# EAGLE design lcdInterface (EAGLE 6.4)
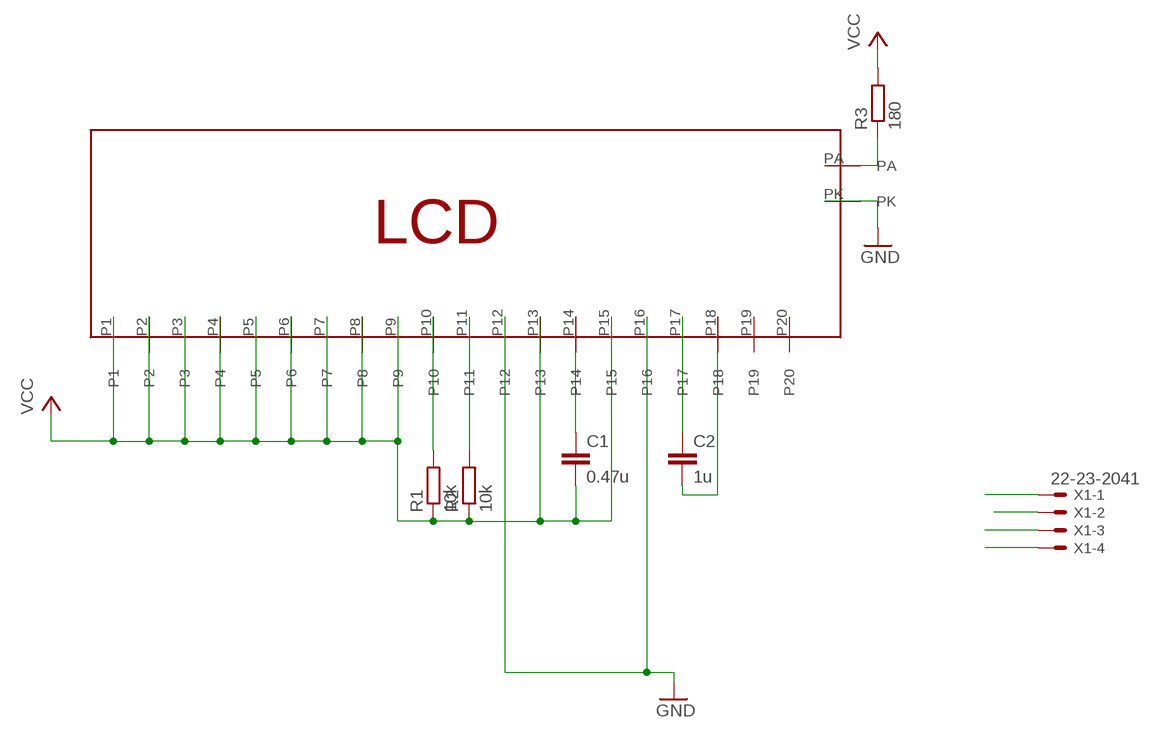
[diagram p0: schematic, sheet 1]

## Parts
C1  0.47u  C-EU050-055X075  [C050-055X075]
C2  1u  C-EU050-030X075  [C050-030X075]
R1  10k  R-EU_0207/10  [0207/10]
R2  10k  R-EU_0207/10  [0207/10]
R3  180  R-EU_0207/10  [0207/10]
U$1  GE-01602F  [GE01602F]
X1  22-23-2041  [22-23-2041]

## Nets
GND: U$1.P12 U$1.P16 U$1.PK X1.4
N$3: R3.1 U$1.PA
N$4: C1.1 U$1.P14
N$5: C2.1 U$1.P17
N$6: C2.2 U$1.P18
SCL: R1.2 U$1.P10 X1.1
SDA: R2.2 U$1.P11 X1.2
VCC: C1.2 R1.1 R2.1 R3.2 U$1.P1 U$1.P2 U$1.P3 U$1.P4 U$1.P5 U$1.P6 U$1.P7 U$1.P8 U$1.P9 U$1.P13 U$1.P15 X1.3
Unconnected: U$1.P19 U$1.P20

## Library data of the parts
C1 C2 = rcl:C-EU: CAPACITOR, European symbol
R1-R3 = resistor:R-EU_: RESISTOR, European symbol
U$1 = lcdDisplay:GE-01602F
X1 = con-molex:22-23-2041: .100" (2.54mm) Center Header - 4 Pin; MF: MOLEX; MPN: 22-23-2041; OC_FARNELL: 1462920; OC_NEWARK: 38C0355

## Board
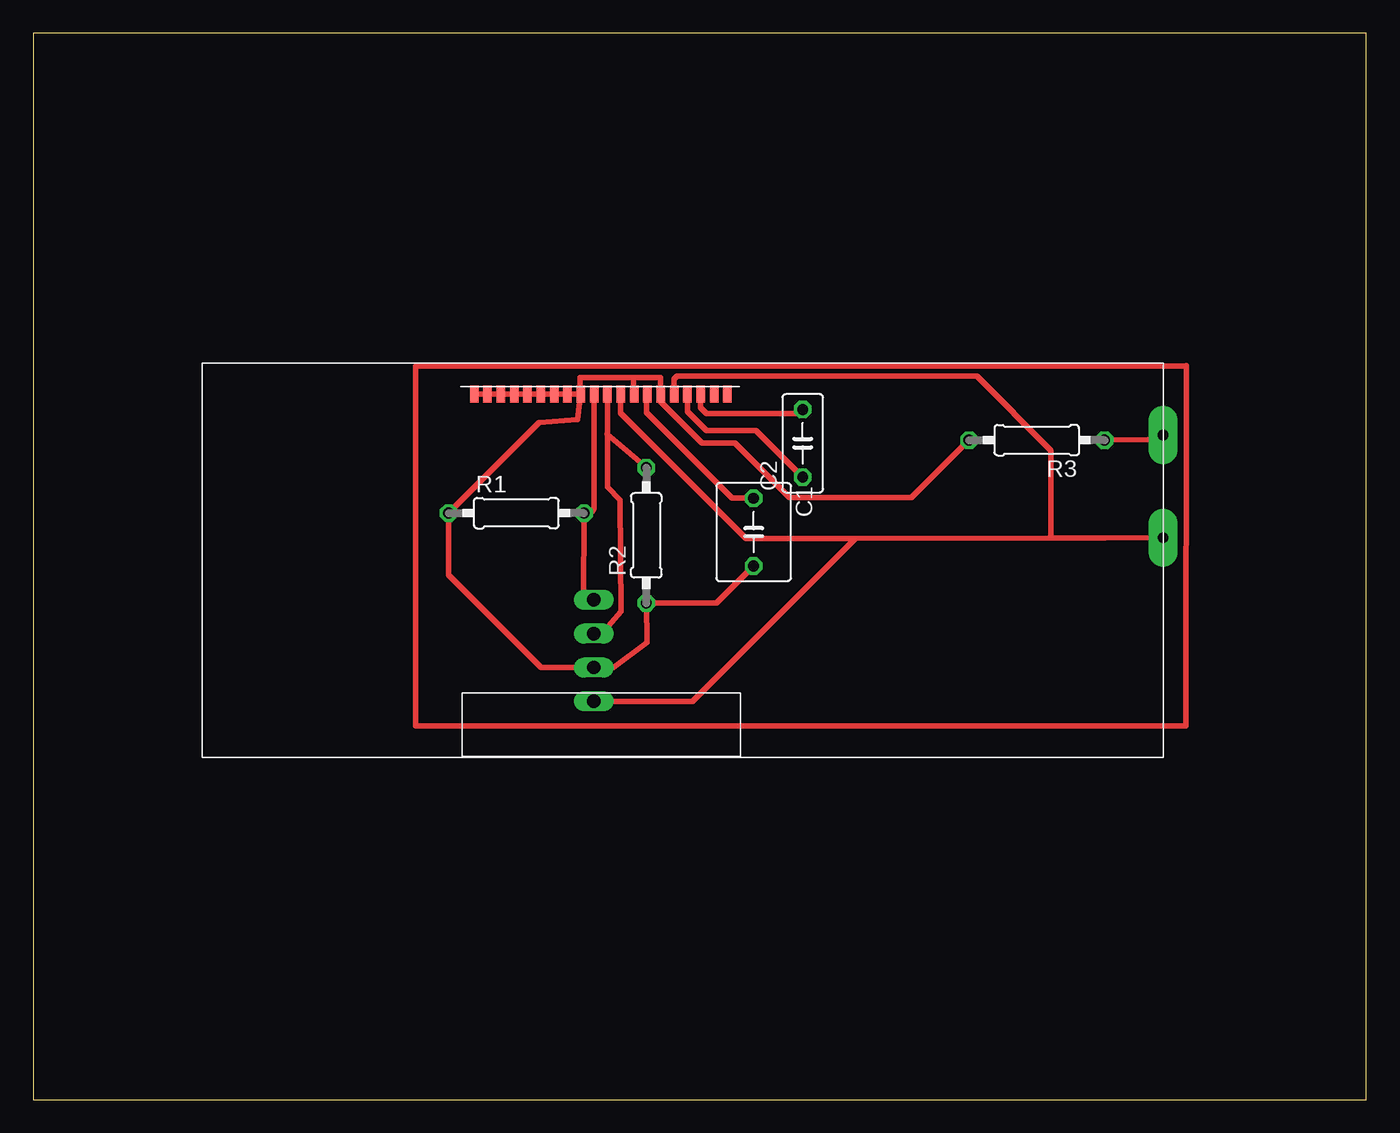
[diagram p1: board, top side]
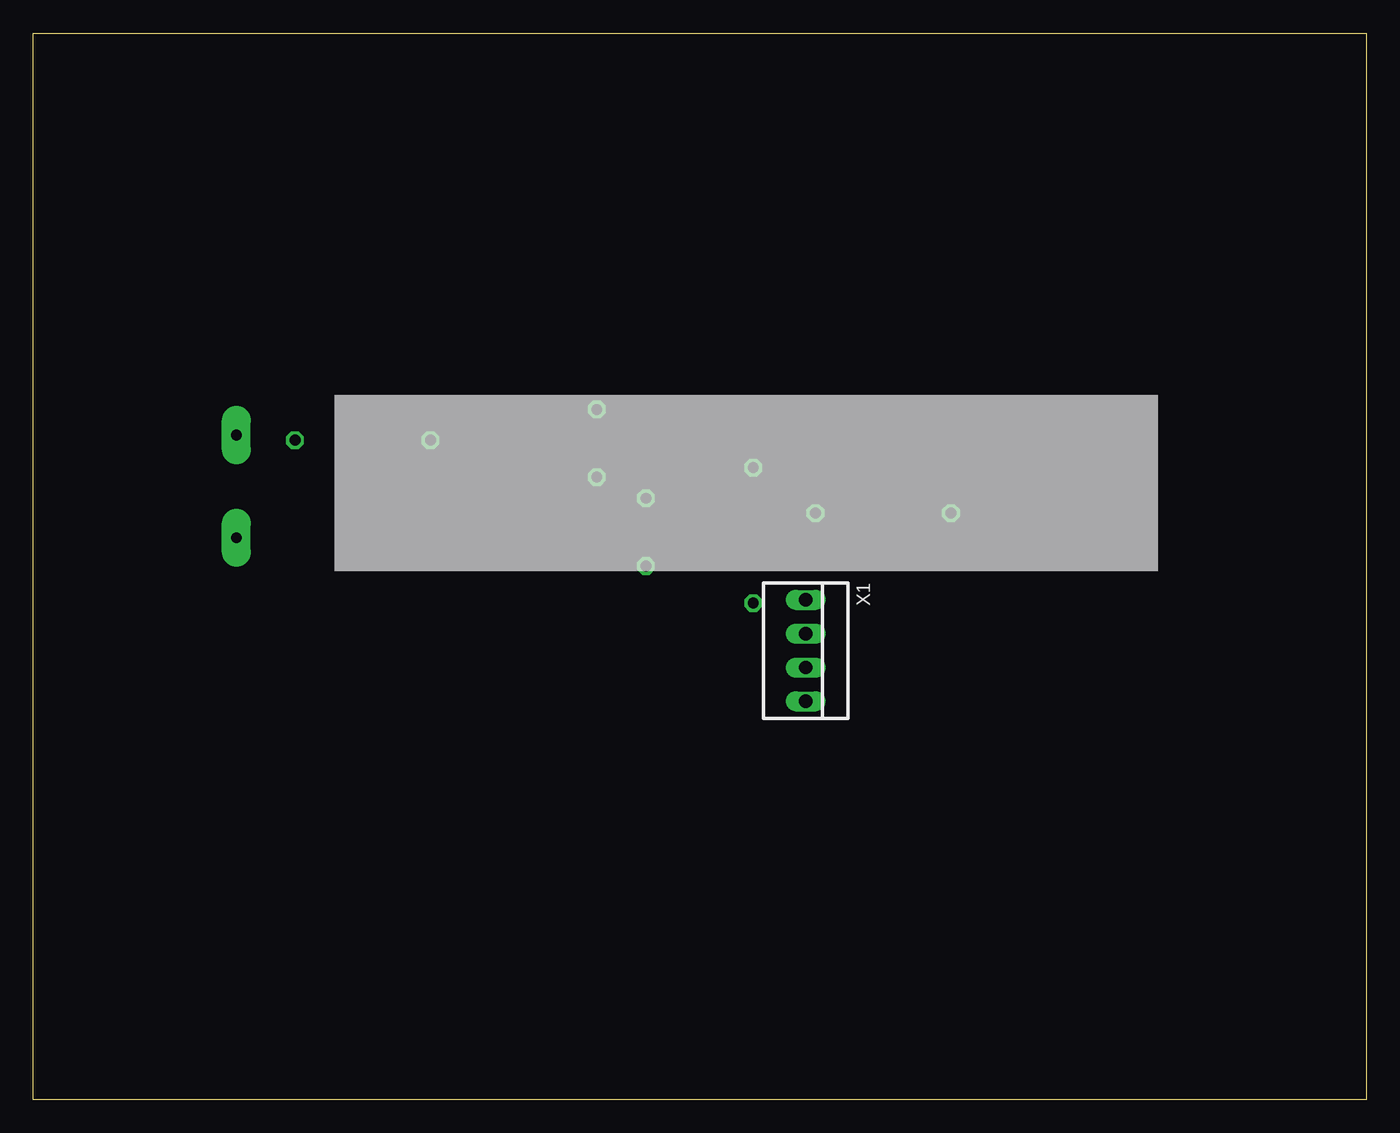
[diagram p2: board, bottom side, seen from below]

Size 100 x 80 mm. Coordinates in mm from the lower left corner, seen from the top.
Outline: 0,0 100,0 100,80 0,80 0,0
Copper layers (1*16): Top 0.035mm / dielectric 1.5mm / Bottom 0.035mm
Design rules "default *": minimum track width 10mil, minimum drill 24mil, track to track 19mil, track to pad 19mil, pad to pad 8mil, via to via 8mil, smd to smd 8mil, copper to edge 40mil, drill to drill 8mil, minimum pad ring 10mil, minimum via ring 8mil, stop-mask expansion 4mil, vias tented up to drill 0mil, thermal gap 10mil

### Footprints (pad centres in the part's own frame; a part is rotated, then mirrored left to right if it is on the bottom)
C050-055X075 = drill 0.813 octagon: 1 -2.54,0; 2 2.54,0
C050-030X075 = drill 0.813 octagon: 1 -2.54,0; 2 2.54,0
0207/10 = drill 0.813 octagon: 1 -5.08,0; 2 5.08,0
GE01602F = smd 0.635 x 1.27: P1 -12.65,17.38; P2 -11.65,17.38; P3 -10.65,17.38; P4 -9.65,17.38; P5 -8.65,17.38; P6 -7.65,17.38; P7 -6.65,17.38; P8 -5.65,17.38; P9 -4.65,17.38; P10 -3.65,17.38; P11 -2.65,17.38; P12 -1.65,17.38; P13 -0.65,17.38; P14 0.35,17.38; P15 1.35,17.38; P16 2.35,17.38; P17 3.35,17.38; P18 4.35,17.38; P19 5.35,17.38; P20 6.35,17.38 | drill 0.8 pad 2.184 long: PA 39.05,14.3; PK 39.05,6.6
22-23-2041 = drill 1 long: 1 -3.81,0; 2 -1.27,0; 3 1.27,0; 4 3.81,0

### Placement (x,y rotation side)
C1  54.04,42.57 270 top
C2  57.72,49.24 90 top
R1  36.24,44 0 top
R2  45.99,42.33 90 top
R3  75.29,49.47 180 top
U$1  45.72,35.56 0 top
X1  42.05,33.69 270 bottom

### Tracks (layer width: path | path; a pad name or v marks a point on that pad's centre or on a via)
GND
  Top 0.406: 61.68,42.09 58,42.08 57.46,42.1 53.46,42.1 44.07,51.49 U$1.P12 | 61.68,42.09 76.21,42.14 | 76.21,42.14 80.38,42.15 U$1.PK | U$1.P16 48.07,54.06 48.28,54.27 70.78,54.27 76.36,48.69 76.36,42.14 76.21,42.14 | X1.4 49.47,29.88 61.68,42.09
N$1
  Top 0.406: 86.49,55.08 86.48,28.03 28.69,28.03 28.69,55.03 86.42,55.03
N$3
  Top 0.406: R3.1 83.65,49.51 84.42,49.51 U$1.PA
N$4
  Top 0.406: U$1.P14 45.99,52.86 45.99,51.56 52.44,45.12 C1.1
N$5
  Top 0.406: U$1.P17 49.07,51.63 50.49,50.21 54.21,50.21 C2.1
N$6
  Top 0.406: 50.07,53.14 U$1.P18 50.07,51.91 50.49,51.49 57.43,51.49 C2.2
SCL
  Top 0.406: U$1.P10 42.07,44.44 arc-90 41.68,44.05 41.28,44.05 R1.2 41.28,37.5 X1.1
SDA
  Top 0.406: X1.2 42.65,34.96 44.09,36.63 44.04,44.99 43.07,45.96 43.07,49.91 | R2.2 43.31,49.7 43.06,49.91 43.07,49.91 | U$1.P11 43.07,49.91
VCC
  Top 0.406: U$1.P1 U$1.P2 U$1.P3 U$1.P4 U$1.P5 U$1.P6 U$1.P7 U$1.P8 U$1.P9 | 45.03,54.18 U$1.P13 | U$1.P9 40.84,51.03 37.95,50.8 R1.1 31.16,39.36 38.09,32.42 X1.3 43.52,32.42 46.06,34.28 R2.1 51.25,37.25 C1.2 | U$1.P9 41.02,54.18 45.03,54.18 | 45.03,54.18 47.07,54.18 U$1.P15 47.07,52.36 50.17,49.26 52.64,49.26 56.73,45.16 65.9,45.16 R3.2